# Altium schematic sheet Microcontroller.SchDoc
size B
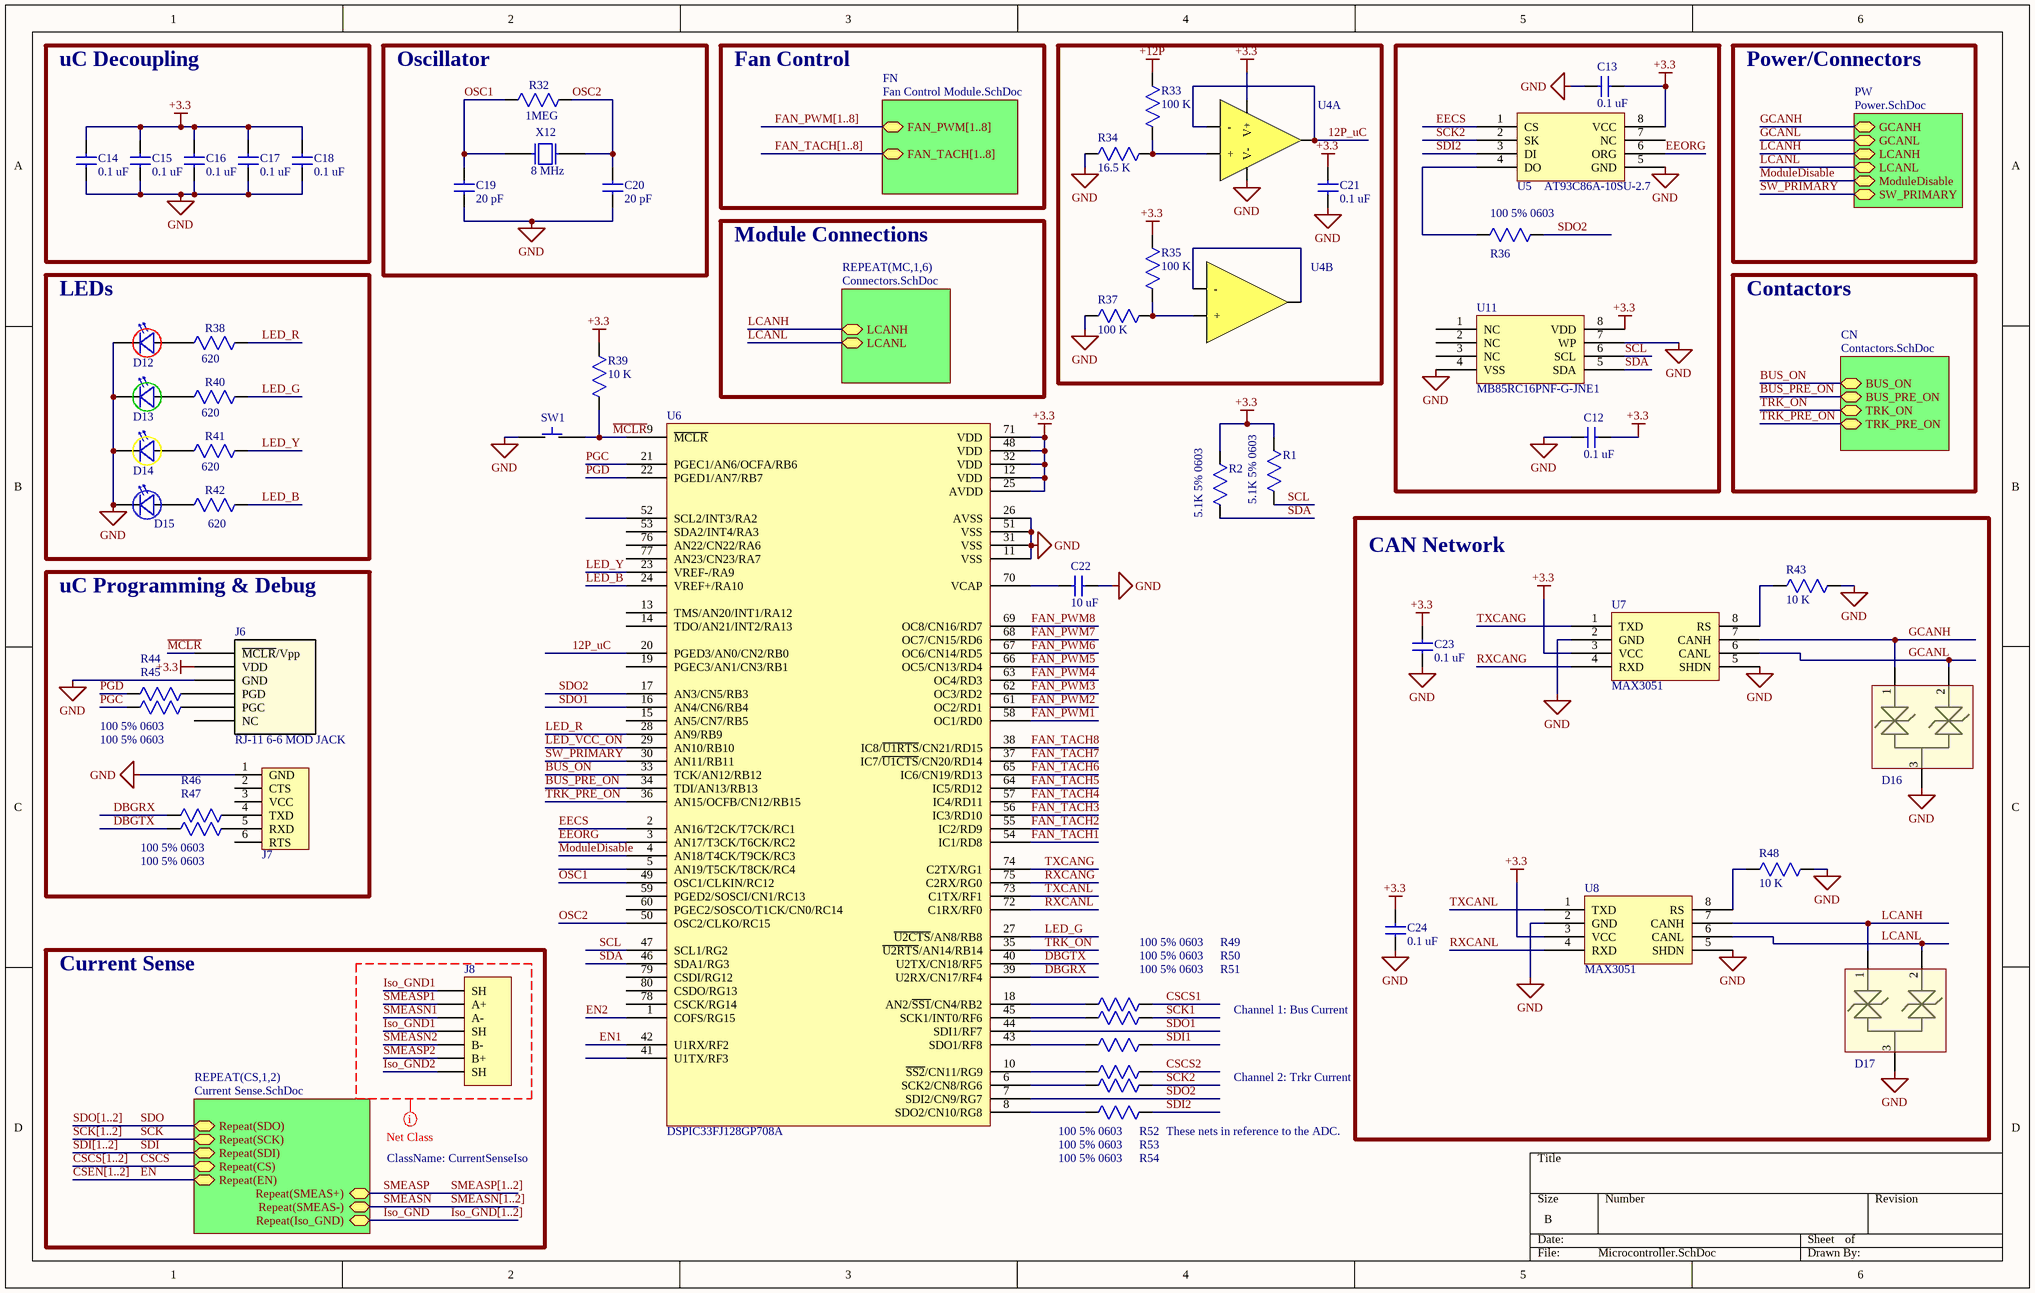
[diagram p0: Microcontroller.SchDoc]

## Parts
C12  value 0.1 uF  [0603_cap]  (hidden comment: CAP 0603)
C13  value 0.1 uF  [0603_cap]  (hidden comment: CAP 0603)
C14  value 0.1 uF  [0603_cap]  (hidden comment: CAP 0603)
C15  value 0.1 uF  [0603_cap]  (hidden comment: CAP 0603)
C16  value 0.1 uF  [0603_cap]  (hidden comment: CAP 0603)
C17  value 0.1 uF  [0603_cap]  (hidden comment: CAP 0603)
C18  value 0.1 uF  [0603_cap]  (hidden comment: CAP 0603)
C19  value 20 pF  [0805_Capacitor]  (hidden comment: CAP 20PF)
C20  value 20 pF  [0805_Capacitor]  (hidden comment: CAP 20PF)
C21  value 0.1 uF  [0603_cap]  (hidden comment: CAP 0603)
C22  value 10 uF  [0805_Capacitor]  (hidden comment: CAP 10 uF)
C23  value 0.1 uF  [0603_cap]  (hidden comment: CAP 0603)
C24  value 0.1 uF  [0603_cap]  (hidden comment: CAP 0603)
D12  D_LED_0805_RED  [0805P_RED]  (value not drawn)
D13  D_LED_0805_GREEN  [0805P_Green]  (value not drawn)
D14  D_LED_0805_YELLOW  [0805P_YELLOW]  (value not drawn)
D15  D_LED_0805_BLUE  [0805_BLUE]  (value not drawn)
D16  CAN TVS  [SOT-23]  (value not drawn)
D17  CAN TVS  [SOT-23]  (value not drawn)
J6  RJ-11 6-6 MOD JACK  [SS-6466-NF]
J7  IDC Connector  [6PIN_1_.100IN]  (value not drawn)
J8  J_SATA_0471554001  [SATA_67800-8005]  (value not drawn)
R1  value 5.1K 5% 0603  [0603_res]  (hidden comment: RES 0603)
R2  value 5.1K 5% 0603  [0603_res]  (hidden comment: RES 0603)
R32  value 1MEG  [0805_Resistor]  (hidden comment: R_0805_1MEG_1%)
R33  value 100 K  [0603_res]  (hidden comment: RES 0603)
R34  value 16.5 K  [0603_res]  (hidden comment: RES 0603)
R35  value 100 K  [0603_res]  (hidden comment: RES 0603)
R36  value 100 5% 0603  [0603_res]  (hidden comment: RES 0603)
R37  value 100 K  [0603_res]  (hidden comment: RES 0603)
R38  value 620  [0805_Resistor]  (hidden comment: R_0805_620_1%)
R39  value 10 K  [0603_res]  (hidden comment: RES 0603)
R40  value 620  [0805_Resistor]  (hidden comment: R_0805_620_1%)
R41  value 620  [0805_Resistor]  (hidden comment: R_0805_620_1%)
R42  value 620  [0805_Resistor]  (hidden comment: R_0805_620_1%)
R43  value 10 K  [0603_res]  (hidden comment: RES 0603)
R44  value 100 5% 0603  [0603_res]  (hidden comment: RES 0603)
R45  value 100 5% 0603  [0603_res]  (hidden comment: RES 0603)
R46  value 100 5% 0603  [0603_res]  (hidden comment: RES 0603)
R47  value 100 5% 0603  [0603_res]  (hidden comment: RES 0603)
R48  value 10 K  [0603_res]  (hidden comment: RES 0603)
R49  value 100 5% 0603  [0603_res]  (hidden comment: RES 0603)
R50  value 100 5% 0603  [0603_res]  (hidden comment: RES 0603)
R51  value 100 5% 0603  [0603_res]  (hidden comment: RES 0603)
R52  value 100 5% 0603  [0603_res]  (hidden comment: RES 0603)
R53  value 100 5% 0603  [0603_res]  (hidden comment: RES 0603)
R54  value 100 5% 0603  [0603_res]  (hidden comment: RES 0603)
SW1  SW_TACT_SWITCH_6x6  [TACT_SWITCH_6x6]  (value not drawn)
U4  IC OP AMP  [SOIC127P600X175-8N]  (value not drawn)  (parts A,B of 2)
U5  AT93C86A-10SU-2.7  [SOIC127P600X175-8N]
U6  DSPIC33FJ128GP708A  [dspic33-tqfp80]
U7  value MAX3051  [SOIC127P600X175-8N]  (hidden comment: U_MAX3051)
U8  value MAX3051  [SOIC127P600X175-8N]  (hidden comment: U_MAX3051)
U11  Manufacturer PN: MB85RC16PNF-G-JNE1  [SOIC127P600X175-8N]  (hidden comment: U_MB85RC16PNF-G-JNE1)
X12  value 8 MHz  [HC-49]  (hidden comment: HC49)

## Blocks framed on the sheet
uC Decoupling: C14-C18
Oscillator: C19 C20 R32 X12
LEDs: D12-D15 R38 R40-R42
CAN Network: C23 C24 D16 D17 R43 R48 U7 U8
uC Programming & Debug: J6 J7 R44-R47
Current Sense: J8

## Sub-sheets
CN = Contactors.SchDoc: BUS_ON, BUS_PRE_ON, TRK_ON, TRK_PRE_ON
FN = Fan Control Module.SchDoc: FAN_PWM[1..8], FAN_TACH[1..8]
PW = Power.SchDoc: GCANH, GCANL, LCANH, LCANL, ModuleDisable, SW_PRIMARY
REPEAT(CS,1,2) = Current Sense.SchDoc: Repeat(SDO), Repeat(SCK), Repeat(SDI), Repeat(CS), Repeat(SMEAS+), Repeat(SMEAS-), Repeat(EN), Repeat(Iso_GND)
REPEAT(MC,1,6) = Connectors.SchDoc: LCANH, LCANL

## Nets
+3.3: C12.2 C13.2 C14.1 C15.1 C16.1 C17.1 C18.1 C21.1 C23.1 C24.1 J6.2(VDD) R1.1 R2.1 R35.1 R39.1 U4.8(V+) U5.8(VCC) U6.12(VDD) U6.25(AVDD) U6.32(VDD) U6.48(VDD) U6.71(VDD) U7.3(VCC) U8.3(VCC) U11.8(VDD)
+12P: R33.1
GND: C12.1 C13.1 C14.2 C15.2 C16.2 C17.2 C18.2 C19.2 C20.2 C21.2 C22.1 C23.2 C24.2 D12.1(Cathode) D13.1(Cathode) D14.1(Cathode) D15.1(Cathode) D16.3 D17.3 J6.3(GND) J7.1(GND) R34.1 R37.1 R43.1 R48.1 SW1.1 U4.4(V-) U5.5(GND) U6.11(VSS) U6.26(AVSS) U6.31(VSS) U6.51(VSS) U7.2(GND) U7.5(SHDN) U8.2(GND) U8.5(SHDN) U11.4(VSS) U11.7(WP)
12P_uC: U4.1(Vo) U4.2(-) U6.20(PGED3/AN0/CN2/RB0)
BUS_ON: U6.33(TCK/AN12/RB12) ; sheet CN/BUS_ON
BUS_PRE_ON: U6.34(TDI/AN13/RB13) ; sheet CN/BUS_PRE_ON
CSCS: sheet REPEAT(CS,1,2)/Repeat(CS)
CSCS1: R51.1
CSCS2: R54.1
DBGRX: R46.2 U6.39(U2RX/CN17/RF4)
DBGTX: R47.2 U6.40(U2TX/CN18/RF5)
EECS: U5.1(CS) U6.2(AN16/T2CK/T7CK/RC1)
EEORG: U5.6(ORG) U6.3(AN17/T3CK/T6CK/RC2)
EN: sheet REPEAT(CS,1,2)/Repeat(EN)
EN1: U6.42(U1RX/RF2)
EN2: U6.1(COFS/RG15)
FAN_PWM1: U6.58(OC1/RD0)
FAN_PWM2: U6.61(OC2/RD1)
FAN_PWM3: U6.62(OC3/RD2)
FAN_PWM4: U6.63(OC4/RD3)
FAN_PWM5: U6.66(OC5/CN13/RD4)
FAN_PWM6: U6.67(OC6/CN14/RD5)
FAN_PWM7: U6.68(OC7/CN15/RD6)
FAN_PWM8: U6.69(OC8/CN16/RD7)
FAN_TACH1: U6.54(IC1/RD8)
FAN_TACH2: U6.55(IC2/RD9)
FAN_TACH3: U6.56(IC3/RD10)
FAN_TACH4: U6.57(IC4/RD11)
FAN_TACH5: U6.64(IC5/RD12)
FAN_TACH6: U6.65(IC6/CN19/RD13)
FAN_TACH7: U6.37(IC7/~{U1CTS}/CN20/RD14)
FAN_TACH8: U6.38(IC8/~{U1RTS}/CN21/RD15)
GCANH: D16.1 U7.7(CANH) ; sheet PW/GCANH
GCANL: D16.2 U7.6(CANL) ; sheet PW/GCANL
Iso_GND: sheet REPEAT(CS,1,2)/Repeat(Iso_GND)
Iso_GND1: J8.1(SH) J8.4(SH)
Iso_GND2: J8.7(SH)
LCANH: D17.1 U8.7(CANH) ; sheet PW/LCANH, sheet REPEAT(MC,1,6)/LCANH
LCANL: D17.2 U8.6(CANL) ; sheet PW/LCANL, sheet REPEAT(MC,1,6)/LCANL
LED_B: R42.1 U6.24(VREF+/RA10)
LED_G: R40.1 U6.27(~{U2CTS}/AN8/RB8)
LED_R: R38.1 U6.28(AN9/RB9)
LED_VCC_ON: U6.29(AN10/RB10)
LED_Y: R41.1 U6.23(VREF-/RA9)
~{MCLR}: J6.1(~{MCLR}/Vpp) R39.2 SW1.2 U6.9(~{MCLR})
ModuleDisable: U6.4(AN18/T4CK/T9CK/RC3) ; sheet PW/ModuleDisable
OSC1: C19.1 R32.2 U6.49(OSC1/CLKIN/RC12) X12.2
OSC2: C20.1 R32.1 U6.50(OSC2/CLKO/RC15) X12.1
PGC: R45.2 U6.21(PGEC1/AN6/OCFA/RB6)
PGD: R44.2 U6.22(PGED1/AN7/RB7)
RXCANG: U6.75(C2RX/RG0) U7.4(RXD)
RXCANL: U6.72(C1RX/RF0) U8.4(RXD)
SCK: sheet REPEAT(CS,1,2)/Repeat(SCK)
SCK1: R50.1
SCK2: R53.1 U5.2(SK)
SCL: R1.2 U6.47(SCL1/RG2) U11.6(SCL)
SDA: R2.2 U6.46(SDA1/RG3) U11.5(SDA)
SDI: sheet REPEAT(CS,1,2)/Repeat(SDI)
SDI1: R49.1
SDI2: R52.1 U5.3(DI)
SDO: sheet REPEAT(CS,1,2)/Repeat(SDO)
SDO1: U6.16(AN4/CN6/RB4) U6.44(SDI1/RF7)
SDO2: R36.1 U6.7(SDI2/CN9/RG7) U6.17(AN3/CN5/RB3)
SMEASN: sheet REPEAT(CS,1,2)/Repeat(SMEAS-)
SMEASN1: J8.3(A-)
SMEASN2: J8.5(B-)
SMEASP: sheet REPEAT(CS,1,2)/Repeat(SMEAS+)
SMEASP1: J8.2(A+)
SMEASP2: J8.6(B+)
SW_PRIMARY: U6.30(AN11/RB11) ; sheet PW/SW_PRIMARY
TRK_ON: U6.35(~{U2RTS}/AN14/RB14) ; sheet CN/TRK_ON
TRK_PRE_ON: U6.36(AN15/OCFB/CN12/RB15) ; sheet CN/TRK_PRE_ON
TXCANG: U6.74(C2TX/RG1) U7.1(TXD)
TXCANL: U6.73(C1TX/RF1) U8.1(TXD)
NetC22_2: C22.2 U6.70(VCAP)
NetD12_2: D12.2(Anode) R38.2
NetD13_2: D13.2(Anode) R40.2
NetD14_2: D14.2(Anode) R41.2
NetD15_2: D15.2(Anode) R42.2
NetJ6_4: J6.4(PGD) R44.1
NetJ6_5: J6.5(PGC) R45.1
NetJ7_4: J7.4(TXD) R46.1
NetJ7_5: J7.5(RXD) R47.1
NetR33_2: R33.2 R34.2 U4.3(+)
NetR35_2: R35.2 R37.2 U4.5(+)
NetR36_2: R36.2 U5.4(DO)
NetR43_2: R43.2 U7.8(RS)
NetR48_2: R48.2 U8.8(RS)
NetR49_2: R49.2 U6.43(SDO1/RF8)
NetR50_2: R50.2 U6.45(SCK1/INT0/RF6)
NetR51_2: R51.2 U6.18(AN2/~{SS1}/CN4/RB2)
NetR52_2: R52.2 U6.8(SDO2/CN10/RG8)
NetR53_2: R53.2 U6.6(SCK2/CN8/RG6)
NetR54_2: R54.2 U6.10(~{SS2}/CN11/RG9)
NetU4_6: U4.6(-) U4.7(Vo)

Not connected (* = marked no-connect by the designer): J6 6(NC); J7 2(CTS) 3(VCC) 6(RTS); U5 7(NC); U6 5(AN19/T5CK/T8CK/RC4) 13(TMS/AN20/INT1/RA12) 14(TDO/AN21/INT2/RA13) 15(AN5/CN7/RB5) 19(PGEC3/AN1/CN3/RB1) 41(U1TX/RF3) 52(SCL2/INT3/RA2) 53(SDA2/INT4/RA3) 59(PGED2/SOSCI/CN1/RC13) 60(PGEC2/SOSCO/T1CK/CN0/RC14) 76(AN22/CN22/RA6) 77(AN23/CN23/RA7) 78(CSCK/RG14) 79(CSDI/RG12) 80(CSDO/RG13); U11 1(NC) 2(NC) 3(NC)

## Buses and harness runs
bus CSCS[1..2]
bus CSEN[1..2]
bus FAN_PWM[1..8] = sheet FN/FAN_PWM[1..8]
bus FAN_TACH[1..8] = sheet FN/FAN_TACH[1..8]
bus Iso_GND[1..2]
bus SCK[1..2]
bus SDI[1..2]
bus SDO[1..2]
bus SMEASN[1..2]
bus SMEASP[1..2]

## Layout directives
net class CurrentSenseIso: Iso_GND1, Iso_GND2, SMEASN1, SMEASN2, SMEASP1, SMEASP2

## Notes on the sheet
- Fan Control
- Power/Connectors
- Module Connections
- Contactors
- Channel 1: Bus Current
- Channel 2: Trkr Current
- These nets in reference to the ADC.

## Library data of the parts
C12-C18 C21 C23 C24 = C_0603: CAP CERM 0603; Known Distributors: Digikey; Package: 0603
C19 C20 = C_0805_20PF_100V_5%: CAP CERM 20PF 5% 100V NP0 0805; Manufacturer: AVX; Manufacturer PN: 08051A200JAT2A; SVP Creator: Jonathan Nutzmann; Package: 0805; Known Distributors: Digikey; ComponentLink1Description: Datasheet; ComponentLink1URL: SVN Datasheet URL; Price: 0.231
C22 = C_0805_10uF: CAP CERM 10 uF; Package: 0805; Known Distributors: Digikey; ComponentLink1Description: Datasheet; ComponentLink1URL: SVN Datasheet URL
D12 = D_LED_0805_RED: LED CHIPLED 645NM RED DIFF 0805; SVP Creator: Jonathan Nutzmann; Current: 20mA; Forward Voltage: 1.8; Package: 0805; Known Distributors: Digikey; Value: RED; ComponentLink1Description: Datasheet
D13 = D_LED_0805_GREEN: LED CHIPLED 570NM GREEN 0805 SMD; Manufacturer: Osram Opto Semiconductors Inc; Manufacturer PN: LG R971-KN-1-0-20-R18; SVP Creator: Nate Bolyard; SVP Reviewer 1: Trevtron; Current: 20mA; Forward Voltage: 2.2V; Package: 0805; Known Distributors: Digikey; Value: GREEN; HelpURL: http://umnsvp.dyndns.org/svn/centaurus2/datasheets/common parts/LG_R971.pdf; ComponentLink1URL: http://umnsvp.dyndns.org/svn/centaurus2/datasheets/common parts/LG_R971.pdf; ComponentLink1Description: Datasheet
D14 = D_LED_0805_YELLOW: LED 595NM AMBER DIFF SMD 0805; SVP Creator: Jonathan Nutzmann; Current: 20mA; Forward Voltage: 1.9; Value: YELLOW; Package: 0805; Known Distributors: Digikey; ComponentLink1Description: Datasheet
D15 = D_LED_0805_BLUE: LED 2X1.2MM 470NM BL WTR CLR SMD; SVP Creator: Jonathan Nutzmann; Current: 20mA; Forward Voltage: 3.3; Value: RED; Package: 0805; Known Distributors: Digikey; ComponentLink1Description: Datasheet
D16 D17 = D_NUP2105: IC CAN BUS PROTECTOR DUAL SOT23; Manufacturer: ON Semiconductor; SVP Creator: Thomas Daede; Package: SOT-23; Manufacturer PN: NUP2105; ComponentLink1Description: Datasheet; ComponentLink1URL: SVN Datasheet URL; Price: 0.50
J6 = J_ICD PROG: SCS RJ-11 Jack
J7 = JP_FTDI_USB: FTDI Cable VCC I/O; SVP Creator: Jonathan Nutzmann
J8 = J_SATA_0471554001: CONN SATA HDR 7POS PCB VERT; Manufacturer: Molex; Known Distributors: Digikey; Manufacturer PN: 0471554001
R1 R2 R33-R37 R39 R43-R54 = R_0603: Known Distributors: Digikey; Package: 0603
R32 = R_0805_1MEG_1%: RES 1MEG OHM 1/8W 1% 0805 SMD; Power Rating: .125W; SVP Creator: Brett Paulsen; Package: 0805; Known Distributor: Digikey; ComponentLink1Description: Datasheet
R38 R40-R42 = R_0805_620_1%: RES 620 OHM 1/8W 1% 0805 SMD; Power Rating: .125W; SVP Creator: Jonathan Nutzmann; Package: 0805; Known Distributor: Digikey; ComponentLink1Description: Datasheet
SW1 = SW_TACT_SWITCH_6x6: SWITCH TACT 6MM BLACK 160GF; Manufacturer: Tyco Electronics; Manufacturer PN: FSM4JH; SVP Creator: Nate Bolyard; Known Distributors: Digikey; Package: 6mm x 6mm
U4 = U_MCP6042T-I/SN: IC OPAMP 1UA 1.4V DUAL R-R 8SOIC; Manufacturer: Microchip; SVP Creator: Jonathan Nutzmann; Package: 8-SOIC; Known Distributors: Digikey; Manufacturer PN: MCP6042T-I/SN; ComponentLink1Description: Datasheet; ComponentLink1URL: SVN Datasheet URL; Price: 0.97
U5 = U_AT93C86A-10SU-2.7: IC EEPROM 16KBIT 2MHZ 8SOIC; Manufacturer: Atmel; Package: SOIC-8; Manufacturer PN: AT93C86A-10SU-2.7
U6 = U_DSPIC33FJ128GP708A: IC DSPIC MCU/DSP 128K 80-TQFP; Manufacturer: Microchip; SVP Creator: Jonathan Nutzmann; Package: 80-TQFP; Known Distributors: Digikey; ComponentLink1Description: Datasheet; ComponentLink1URL: SVN Datasheet URL; Manufacturer PN: DSPIC33FJ128GP708A
U7 U8 = U_MAX3051: IC TXRX CAN 1MBPS 8-SOIC 3.3V; Manufacturer: Maxim; Manufacturer PN: MAX3051ESA+; SVP Creator: Jonathan Nutzmann; Package: SOIC-8; Known Distributors: DigiKey; ComponentLink1Description: Datasheet
U11 = U_MB85RC16PNF-G-JNE1: IC FRAM 16KBIT 1MHZ 8SOP; Manufacturer: Fujitsu Semiconductor America Inc; Package: SOIC-8; Known Distributors: DigiKey; ComponentLink1Description: Datasheet
X12 = X_HC49: CRYSTAL 8.00 MHZ 20PF 49US; Manufacturer: ECS; Manufacturer PN: ECS-80-20-4X; SVP Creator: Jonathan Nutzmann; Load Capacitance: 20pF; Known Distributor: Digikey; Package: HC49/US; ComponentLink1Description: Datasheet